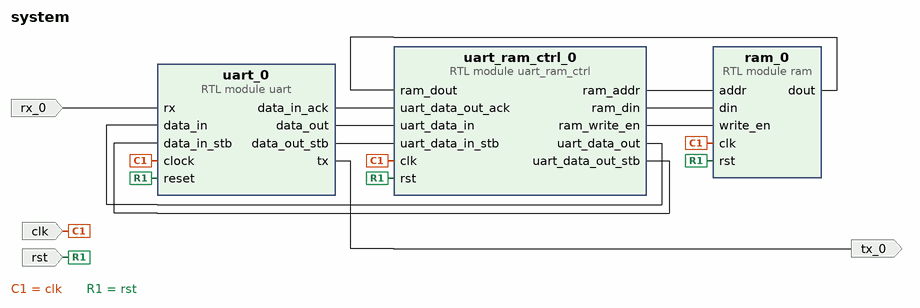
[diagram p0: block diagram of the top level]
# Vivado block design system, xc7s25csga225-1, Vivado 2025.1
create_bd_design system

create_bd_port -dir I -type clk clk
set_property -dict {CONFIG.FREQ_HZ 50000000} [get_bd_ports clk]
create_bd_port -dir I rst
create_bd_port -dir O tx_0
create_bd_port -dir I rx_0

create_bd_cell -type module -reference ram ram_0
create_bd_cell -type module -reference uart uart_0
create_bd_cell -type module -reference uart_ram_ctrl uart_ram_ctrl_0

# ---- connections ----

connect_bd_net [get_bd_ports clk] [get_bd_pins uart_ram_ctrl_0/clk] [get_bd_pins uart_0/clock] [get_bd_pins ram_0/clk]
connect_bd_net [get_bd_pins ram_0/dout] [get_bd_pins uart_ram_ctrl_0/ram_dout]
connect_bd_net [get_bd_ports rst] [get_bd_pins uart_ram_ctrl_0/rst] [get_bd_pins ram_0/rst] [get_bd_pins uart_0/reset]
connect_bd_net -net rx_0_1 [get_bd_ports rx_0] [get_bd_pins uart_0/rx]
connect_bd_net [get_bd_pins uart_0/data_in_ack] [get_bd_pins uart_ram_ctrl_0/uart_data_out_ack]
connect_bd_net [get_bd_pins uart_0/data_out] [get_bd_pins uart_ram_ctrl_0/uart_data_in]
connect_bd_net [get_bd_pins uart_0/data_out_stb] [get_bd_pins uart_ram_ctrl_0/uart_data_in_stb]
connect_bd_net [get_bd_pins uart_0/tx] [get_bd_ports tx_0]
connect_bd_net [get_bd_pins uart_ram_ctrl_0/ram_addr] [get_bd_pins ram_0/addr]
connect_bd_net [get_bd_pins uart_ram_ctrl_0/ram_din] [get_bd_pins ram_0/din]
connect_bd_net [get_bd_pins uart_ram_ctrl_0/ram_write_en] [get_bd_pins ram_0/write_en]
connect_bd_net [get_bd_pins uart_ram_ctrl_0/uart_data_out] [get_bd_pins uart_0/data_in]
connect_bd_net [get_bd_pins uart_ram_ctrl_0/uart_data_out_stb] [get_bd_pins uart_0/data_in_stb]

validate_bd_design
save_bd_design
